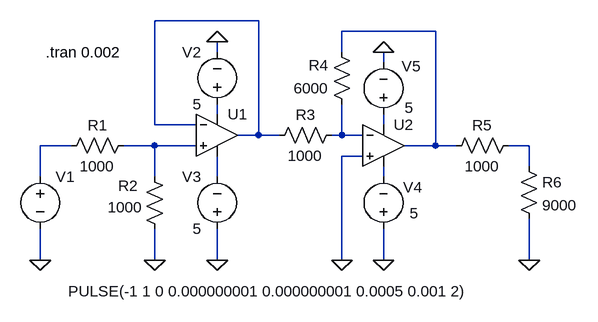
[diagram p0: schematic CircuitABC-PartC-AC.asc]
CircuitABC-PartC-AC.asc, the LTspice schematic file:
Version 4.1
SHEET 1 880 680
WIRE 384 -128 224 -128
WIRE 656 -112 512 -112
WIRE 320 -80 320 -96
WIRE 512 -80 512 -112
WIRE 576 -64 576 -80
WIRE 320 16 320 0
WIRE 224 32 224 -128
WIRE 288 32 224 32
WIRE 576 32 576 16
WIRE 384 48 384 -128
WIRE 384 48 352 48
WIRE 416 48 384 48
WIRE 512 48 512 0
WIRE 512 48 496 48
WIRE 544 48 512 48
WIRE 96 64 48 64
WIRE 224 64 176 64
WIRE 288 64 224 64
WIRE 656 64 656 -112
WIRE 656 64 608 64
WIRE 688 64 656 64
WIRE 800 64 768 64
WIRE 544 80 512 80
WIRE 800 96 800 64
WIRE 48 112 48 64
WIRE 224 112 224 64
WIRE 320 112 320 80
WIRE 576 112 576 96
WIRE 48 240 48 192
WIRE 224 240 224 192
WIRE 320 240 320 192
WIRE 512 240 512 80
WIRE 576 240 576 192
WIRE 800 240 800 176
FLAG 224 240 0
FLAG 48 240 0
FLAG 512 240 0
FLAG 800 240 0
FLAG 320 240 0
FLAG 320 -96 0
FLAG 576 240 0
FLAG 576 -80 0
SYMBOL voltage 48 96 R0
WINDOW 3 43 192 Left 2
WINDOW 123 0 0 Left 0
WINDOW 39 0 0 Left 0
SYMATTR InstName V1
SYMATTR Value PULSE(-1 1 0 0.000000001 0.000000001 0.0005 0.001 2)
SYMBOL res 192 48 R90
WINDOW 0 0 56 VBottom 2
WINDOW 3 32 56 VTop 2
SYMATTR InstName R1
SYMATTR Value 1000
SYMBOL res 208 96 R0
WINDOW 0 -40 30 Left 2
WINDOW 3 -56 63 Left 2
SYMATTR InstName R2
SYMATTR Value 1000
SYMBOL res 512 32 R90
WINDOW 0 0 56 VBottom 2
WINDOW 3 32 56 VTop 2
SYMATTR InstName R3
SYMATTR Value 1000
SYMBOL res 784 48 R90
WINDOW 0 0 56 VBottom 2
WINDOW 3 32 56 VTop 2
SYMATTR InstName R5
SYMATTR Value 1000
SYMBOL res 784 80 R0
SYMATTR InstName R6
SYMATTR Value 9000
SYMBOL OpAmps\\UniversalOpAmp 320 48 R0
SYMATTR InstName U1
SYMBOL OpAmps\\UniversalOpAmp 576 64 R0
SYMATTR InstName U2
SYMBOL res 528 16 R180
WINDOW 0 36 76 Left 2
WINDOW 3 36 40 Left 2
SYMATTR InstName R4
SYMATTR Value 6000
SYMBOL voltage 320 16 R180
WINDOW 0 24 96 Left 2
WINDOW 3 24 16 Left 2
WINDOW 123 0 0 Left 0
WINDOW 39 0 0 Left 0
SYMATTR InstName V2
SYMATTR Value 5
SYMBOL voltage 320 208 R180
WINDOW 0 24 96 Left 2
WINDOW 3 24 16 Left 2
WINDOW 123 0 0 Left 0
WINDOW 39 0 0 Left 0
SYMATTR InstName V3
SYMATTR Value 5
SYMBOL voltage 576 208 R180
WINDOW 0 -60 80 Left 2
WINDOW 3 -54 40 Left 2
WINDOW 123 0 0 Left 0
WINDOW 39 0 0 Left 0
SYMATTR InstName V4
SYMATTR Value 5
SYMBOL voltage 576 32 R180
WINDOW 0 -57 90 Left 2
WINDOW 3 -46 26 Left 2
WINDOW 123 0 0 Left 0
WINDOW 39 0 0 Left 0
SYMATTR InstName V5
SYMATTR Value 5
TEXT 56 -80 Left 2 !.tran 0.002

The netlist it stands for:
* CircuitABC-PartC-AC.asc
V1 N006 0 PULSE(-1 1 0 0.000000001 0.000000001 0.0005 0.001 2)
R1 N007 N006 1000
R2 N007 0 1000
R3 N005 N001 1000
R5 N008 N002 1000
R6 N008 0 9000
X§U1 N007 N001 N003 N009 N001 level1 Avol=1Meg GBW=10Meg Vos=0 En=0 Enk=0 In=0 Ink=0 Rin=500Meg  ; pins In+ In- V+ V- OUT
X§U2 0 N005 N004 N010 N002 level1 Avol=1Meg GBW=10Meg Vos=0 En=0 Enk=0 In=0 Ink=0 Rin=500Meg  ; pins In+ In- V+ V- OUT
R4 N005 N002 6000
V2 N003 0 5
V3 0 N009 5
V4 0 N010 5
V5 N004 0 5
.tran 0.002
.lib UniversalOpAmp1.lib
.backanno
.end